# EAGLE design edr (EAGLE 6.2)
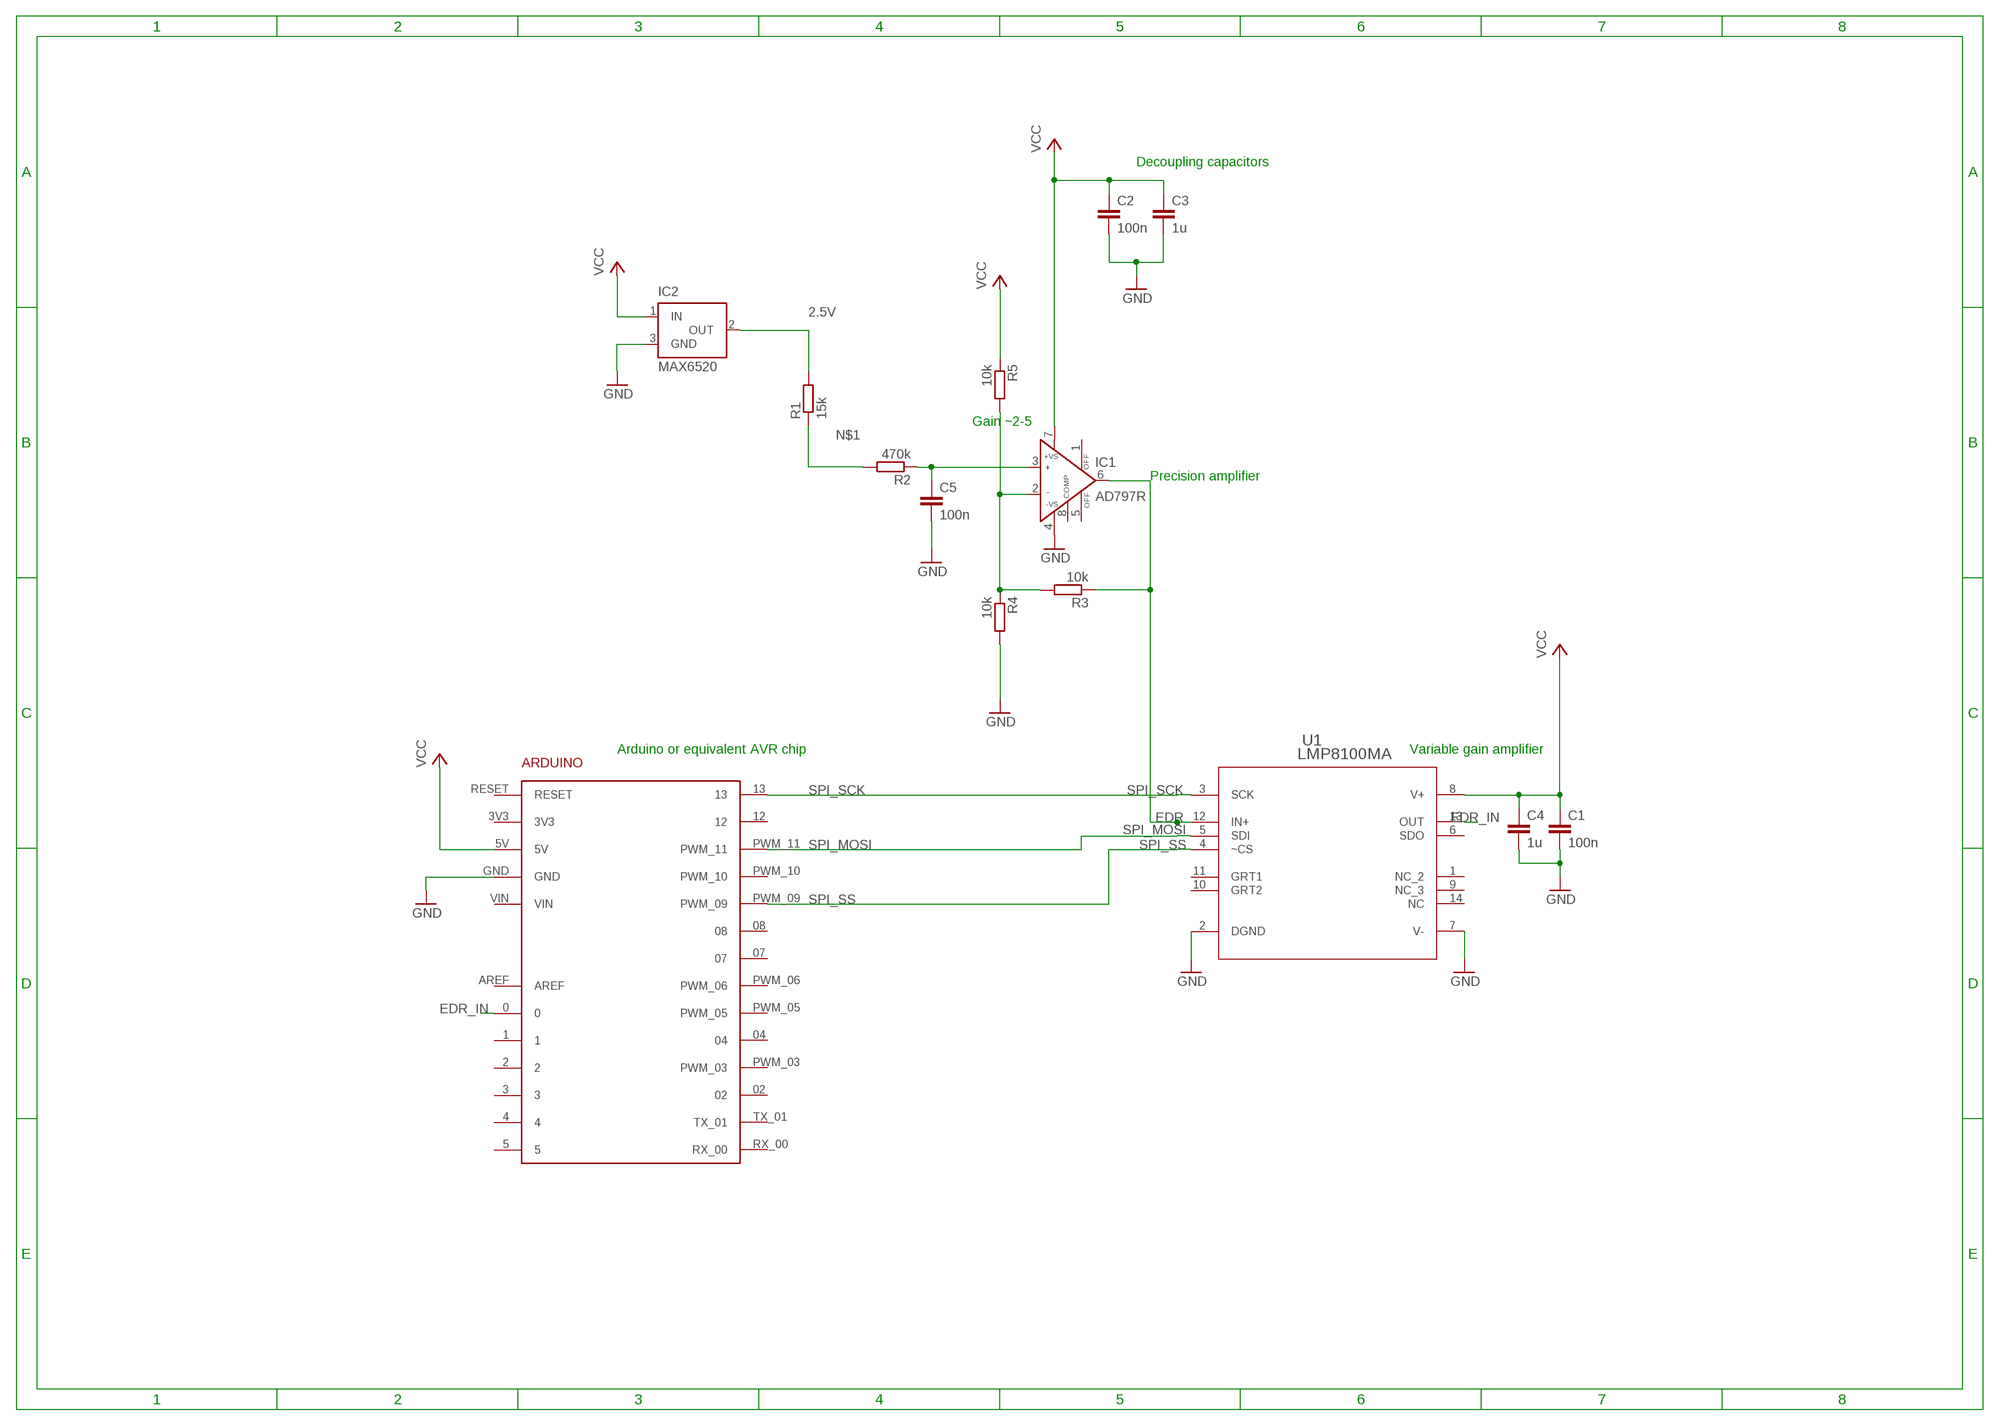
[diagram p0: schematic, sheet 1]

## Parts
ARDUINO1  ARDUINO2  [ARDUINO2]
C1  100n  C-EUC0603  [C0603]
C2  100n  C-EUC0603  [C0603]
C3  1u  C-EUC0805  [C0805]
C4  1u  C-EUC0805  [C0805]
C5  100n  C-EUC0603  [C0603]
IC1  AD797R  [SO8]
IC2  MAX6520  [SOT23]
R1  15k  R-EU_R0603  [R0603]
R2  470k  R-EU_R0603  [R0603]
R3  10k  R-EU_R0603  [R0603]
R4  10k  R-EU_R0603  [R0603]
R5  10k  R-EU_R0603  [R0603]
U1  LMP8100MA  [M14A]

## Nets
2.5V: IC2.2(OUT) R1.2
EDR: IC1.6(OUT) R3.1 U1.12(IN+)
EDR_IN: ARDUINO1.0 U1.13(OUT)
GND: ARDUINO1.GND C1.2 C2.2 C3.2 C4.2 C5.2 IC1.4(-VS) IC2.3(GND) R4.2 U1.2(DGND) U1.7(V-)
N$1: R1.1 R2.2
N$2: C5.1 IC1.3(IN+) R2.1
N$5: IC1.2(IN-) R3.2 R4.1 R5.2
SPI_MOSI: ARDUINO1.PWM_11 U1.5(SDI)
SPI_SCK: ARDUINO1.13 U1.3(SCK)
SPI_SS: ARDUINO1.PWM_09 U1.4(~CS)
VCC: ARDUINO1.5V C1.1 C2.1 C3.1 C4.1 IC1.7(+VS) IC2.1(IN) R5.1 U1.8(V+)
Unconnected: ARDUINO1.1 ARDUINO1.02 ARDUINO1.2 ARDUINO1.3 ARDUINO1.3V3 ARDUINO1.4 ARDUINO1.04 ARDUINO1.5 ARDUINO1.07 ARDUINO1.08 ARDUINO1.12 ARDUINO1.AREF ARDUINO1.PWM_03 ARDUINO1.PWM_05 ARDUINO1.PWM_06 ARDUINO1.PWM_10 ARDUINO1.RESET ARDUINO1.RX_00 ARDUINO1.TX_01 ARDUINO1.VIN IC1.1(OFF) IC1.5(OFF) IC1.8(COMP) U1.1(NC_2) U1.6(SDO) U1.9(NC_3) U1.10(GRT2) U1.11(GRT1) U1.14(NC)

## Notes on the sheet
- Decoupling capacitors
- Gain ~2-5
- Precision amplifier
- Arduino or equivalent AVR chip | Variable gain amplifier

## Library data of the parts
ARDUINO1 = arduino:ARDUINO: For creating Arduino shields
C1-C5 = rcl:C-EU: CAPACITOR, European symbol
IC1 = analog-devices:AD797: Ultralow Distortion, Ultralow Noise Op Amp Source: http://www.analog.com/static/imported-files/data_sheets/AD797.pdf; MF: ALTERA CORPORATION; MPN: AD797ARZ; OC_FARNELL: 9426450; OC_NEWARK: 88H0085
IC2 = maxim:MAX6520: 1.2V Voltage Reference 50ppm/°C, SOT23, 3-Terminal Source: Data sheet <http://datasheets.maxim-ic.com/en/ds/MAX6520.pdf>; MF: MAXIM; MPN: MAX6520EUR-T; OC_FARNELL: unknown; OC_NEWARK: 02J4586
R1-R5 = rcl:R-EU_: RESISTOR, European symbol
U1 = ti_lmp8100:LMP8100MA

## Board
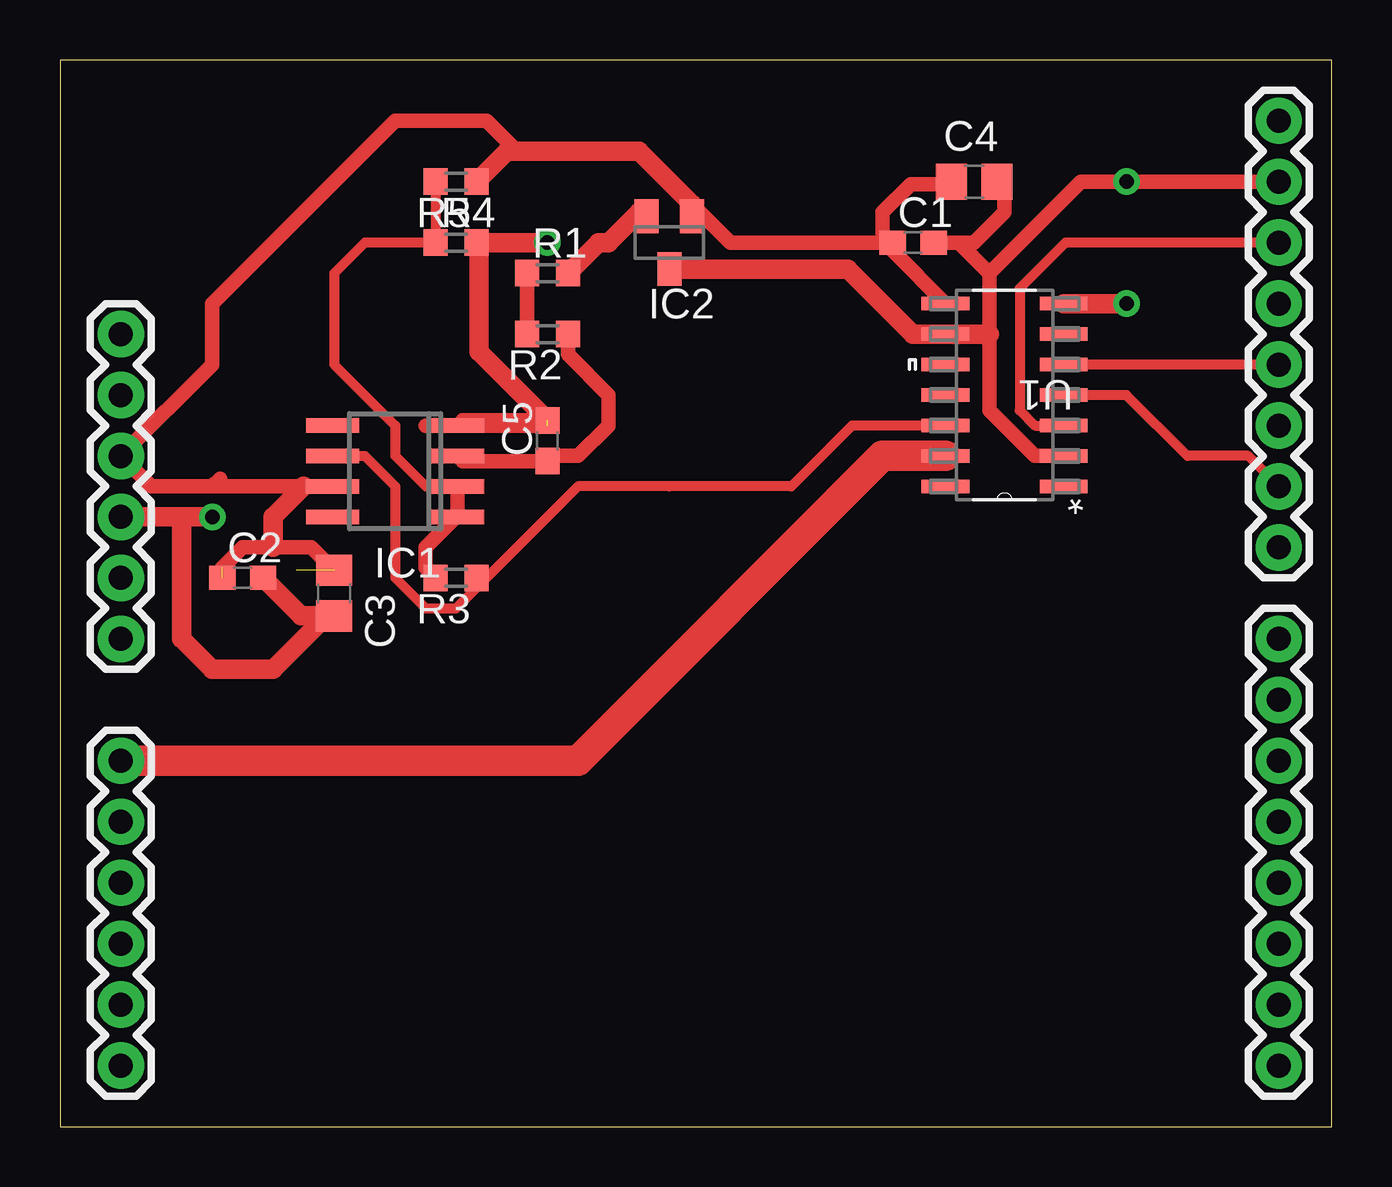
[diagram p1: board, top side]
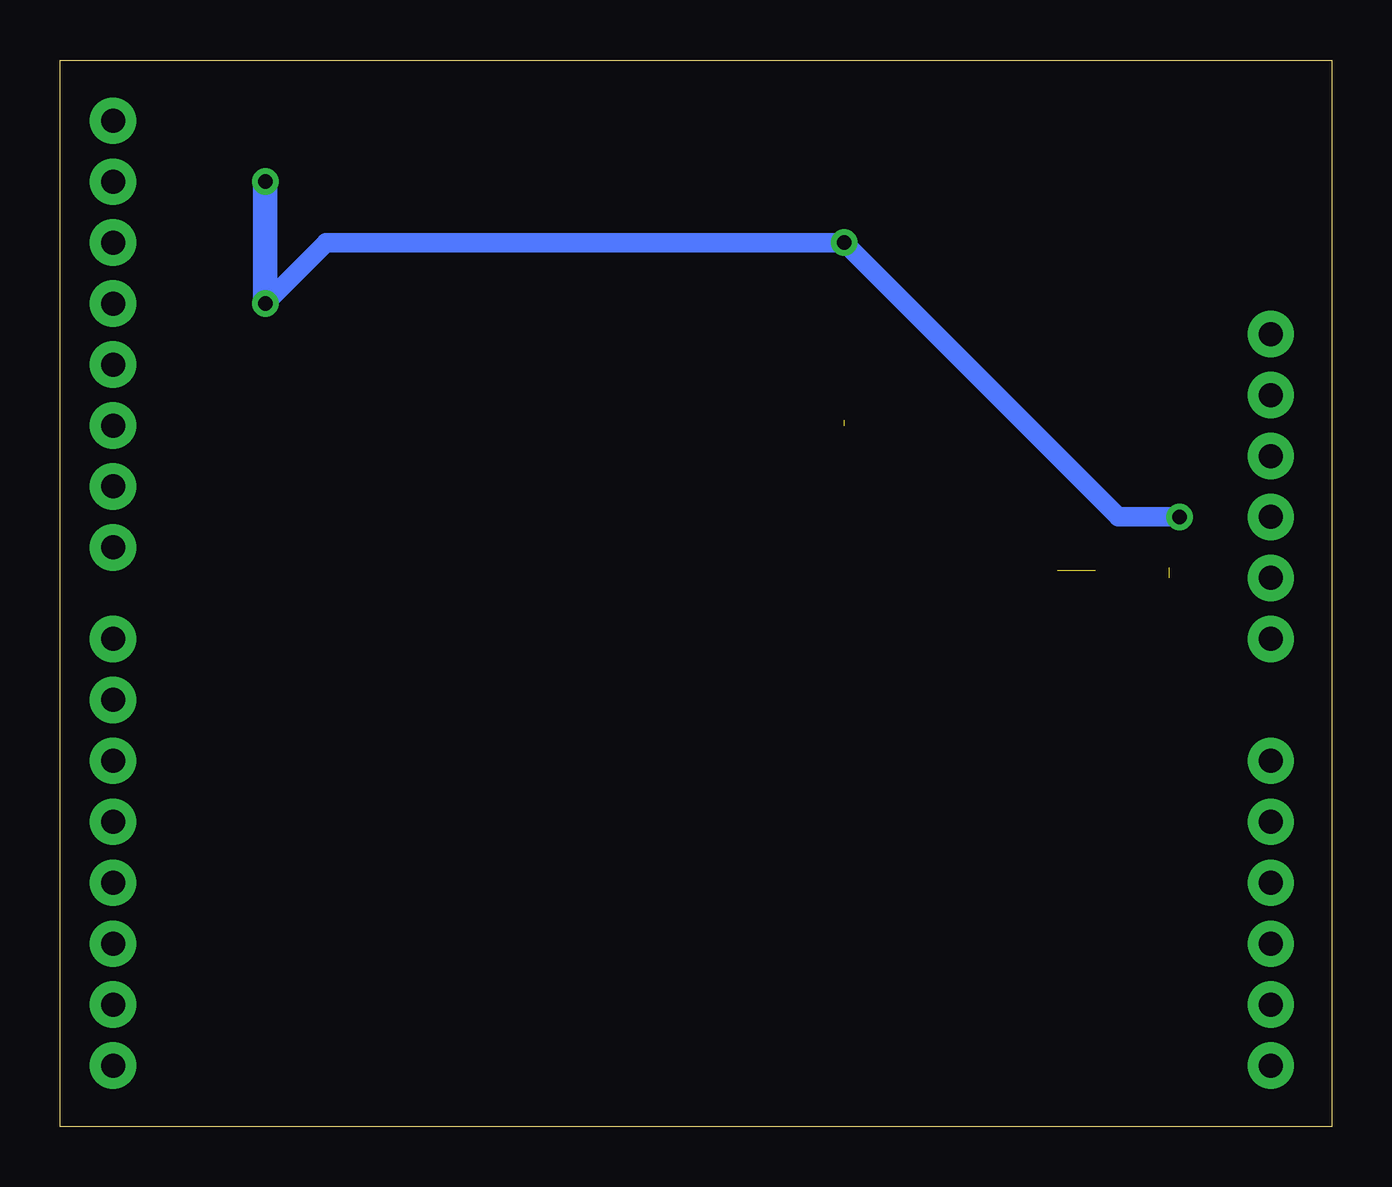
[diagram p2: board, bottom side, seen from below]

Size 53.01 x 44.44 mm. Coordinates in mm from the lower left corner, seen from the top.
Outline: 0,0 53.01,0 53.01,44.44 0,44.44 0,0
Copper layers (1*16): Top 0.035mm / dielectric 1.5mm / Bottom 0.035mm
Design rules: minimum track width 8mil, minimum drill 20mil, track to track 8mil, track to pad 8mil, pad to pad 8mil, via to via 8mil, smd to smd 8mil, copper to edge 10mil, drill to drill 8mil, minimum pad ring 12mil, minimum via ring 10mil, stop-mask expansion 4mil, vias tented up to drill 25mil, thermal gap 10mil

### Footprints (pad centres in the part's own frame; a part is rotated, then mirrored left to right if it is on the bottom)
ARDUINO2 = drill 1 pad 1.93: 0 0,12.7; 1 0,10.16; 2 0,7.62; 02 48.26,5.08; 3 0,5.08; 3V3 0,27.94; 4 0,2.54; 04 48.26,10.16; 5 0,0; 5V 0,25.4; 07 48.26,17.78; 08 48.26,21.59; 12 48.26,31.75; 13 48.26,34.29; AREF 48.26,39.37; GND 0,22.86; GND1 0,20.32; GND2 48.26,36.83; PWM_03 48.26,7.62; PWM_05 48.26,12.7; PWM_06 48.26,15.24; PWM_09 48.26,24.13; PWM_10 48.26,26.67; PWM_11 48.26,29.21; RESET 0,30.48; RX_00 48.26,0; TX_01 48.26,2.54; VIN 0,17.78
C0603 = smd 1.1 x 1: 1 -0.85,0; 2 0.85,0
C0805 = smd 1.3 x 1.5: 1 -0.95,0; 2 0.95,0
SO8 = smd 0.6 x 2.2: 1 -1.905,-2.6; 2 -0.635,-2.6; 3 0.635,-2.6; 4 1.905,-2.6; 5 1.905,2.6; 6 0.635,2.6; 7 -0.635,2.6; 8 -1.905,2.6
SOT23 = smd 1 x 1.4: 1 -0.95,-1.1; 2 0.95,-1.1; 3 0,1.1
R0603 = smd 1 x 1.1: 1 -0.85,0; 2 0.85,0
M14A = smd 1.981 x 0.559: 1 -2.464,3.81; 2 -2.464,2.54; 3 -2.464,1.27; 4 -2.464,0; 5 -2.464,-1.27; 6 -2.464,-2.54; 7 -2.464,-3.81; 8 2.464,-3.81; 9 2.464,-2.54; 10 2.464,-1.27; 11 2.464,0; 12 2.464,1.27; 13 2.464,2.54; 14 2.464,3.81

### Placement (x,y rotation side)
ARDUINO1  2.54,2.54 0 top
C1  35.56,36.83 0 top
C2  7.62,22.86 0 top
C3  11.43,22.23 270 top
C4  38.1,39.37 0 top
C5  20.32,28.57 90 top
IC1  13.97,27.3 90 top
IC2  25.4,36.83 180 top
R1  20.32,35.56 0 top
R2  20.32,33.02 180 top
R3  16.51,22.86 180 top
R4  16.51,36.83 0 top
R5  16.51,39.37 180 top
U1  39.37,30.48 180 top

### Tracks (layer width: path | path; a pad name or v marks a point on that pad's centre or on a via)
2.5V
  Top 0.813: IC2.2 24.3,37.93 24.13,38.1 22.86,36.83 22.44,36.83 R1.2
EDR
  Top 0.406: U1.12 33.02,29.21 30.48,26.67 25.4,26.67 21.59,26.67 17.78,22.86 | 17.78,22.86 R3.1 17.78,22.86 | IC1.6 12.7,27.94 13.97,26.67 13.97,22.86 15.24,21.59 16.51,21.59 17.78,22.86
EDR_IN
  Top 1.27: ARDUINO1.0 21.59,15.24 34.29,27.94 U1.13
GND  (via drill 0.6)  (1 unrouted)
  Top 0.61: 38.73,35.56 42.54,39.37 43.18,39.37 v44.45,39.37 50.8,39.37 | 38.73,35.56 38.73,33.02 38.73,29.84 40.64,27.94 U1.2 | C5.2 16.78,29.43 IC1.4 | 17.46,36.73 R4.2 | 15.24,29.21 20.32,29.21 | C1.2 36.51,36.83 | 36.51,36.83 37.46,36.83 38.73,35.56 | 36.51,36.83 38.1,36.83 39.37,38.1 39.37,39.05 C4.2
  Top 0.813: U1.7 v44.45,34.29 | IC2.3 32.85,35.73 35.56,33.02 38.73,33.02 | R4.2 v20.32,36.83 | ARDUINO1.GND 5.08,25.4 | 5.08,25.4 v6.35,25.4 | 5.08,25.4 5.08,20.32 6.35,19.05 8.89,19.05 11.11,21.27 C3.2 10.05,21.27 C2.2 | 17.46,36.73 17.46,32.28 C5.2
  Bottom 0.813: v44.45,34.29 41.91,36.83 v20.32,36.83 8.89,25.4 v6.35,25.4
  Bottom 1.016: v44.45,34.29 v44.45,39.37
N$1
  Top 0.61: R1.1 R2.2
N$2
  Top 0.61: IC1.3 16.78,27.73 C5.1 20.54,27.94 21.59,27.94 22.86,29.21 22.86,30.48 21.17,32.17 R2.1
N$5
  Top 0.406: R5.2 R4.1 15.24,36.83 12.7,36.83 11.43,35.56 11.43,31.75 13.97,29.21 13.97,27.94 15.24,26.67 IC1.2
  Top 0.61: R3.2 15.24,23.28 15.24,24.13 16.51,25.4 16.57,25.46 IC1.2
SPI_MOSI
  Top 0.406: ARDUINO1.PWM_11 U1.5
SPI_SCK
  Top 0.406: ARDUINO1.13 41.91,36.83 40.01,34.92 40.01,29.84 40.64,29.21 U1.3
SPI_SS
  Top 0.406: ARDUINO1.PWM_09 49.53,27.94 46.99,27.94 44.45,30.48 43.18,30.48 U1.4
VCC  (2 unrouted)
  Top 0.61: 19.05,40.64 17.78,41.91 13.97,41.91 6.35,34.29 6.35,31.75 ARDUINO1.5V 3.81,26.67 6.35,26.67 | IC1.7 10.16,26.67 6.35,26.67 | 6.67,26.99 6.35,26.67 | C4.1 37.15,39.27 35.46,39.27 34.29,38.1 34.29,37.25 C1.1 | C1.1 27.94,36.83 26.67,38.1 26.52,38.1 IC2.1 | 6.77,23.28 7.62,24.13 8.04,24.13 8.89,24.13 10.48,24.13 C3.1 | C1.1 34.71,36.49 U1.8
  Top 0.813: IC2.1 26.35,38.42 24.13,40.64 19.05,40.64 18.63,40.64 R5.1 | 8.89,24.13 8.89,25.4 10.16,26.67